# Altium schematic sheet Peripherals.SchDoc: Peripherals
size A4; SheetNumber: 2; SheetTotal: 2
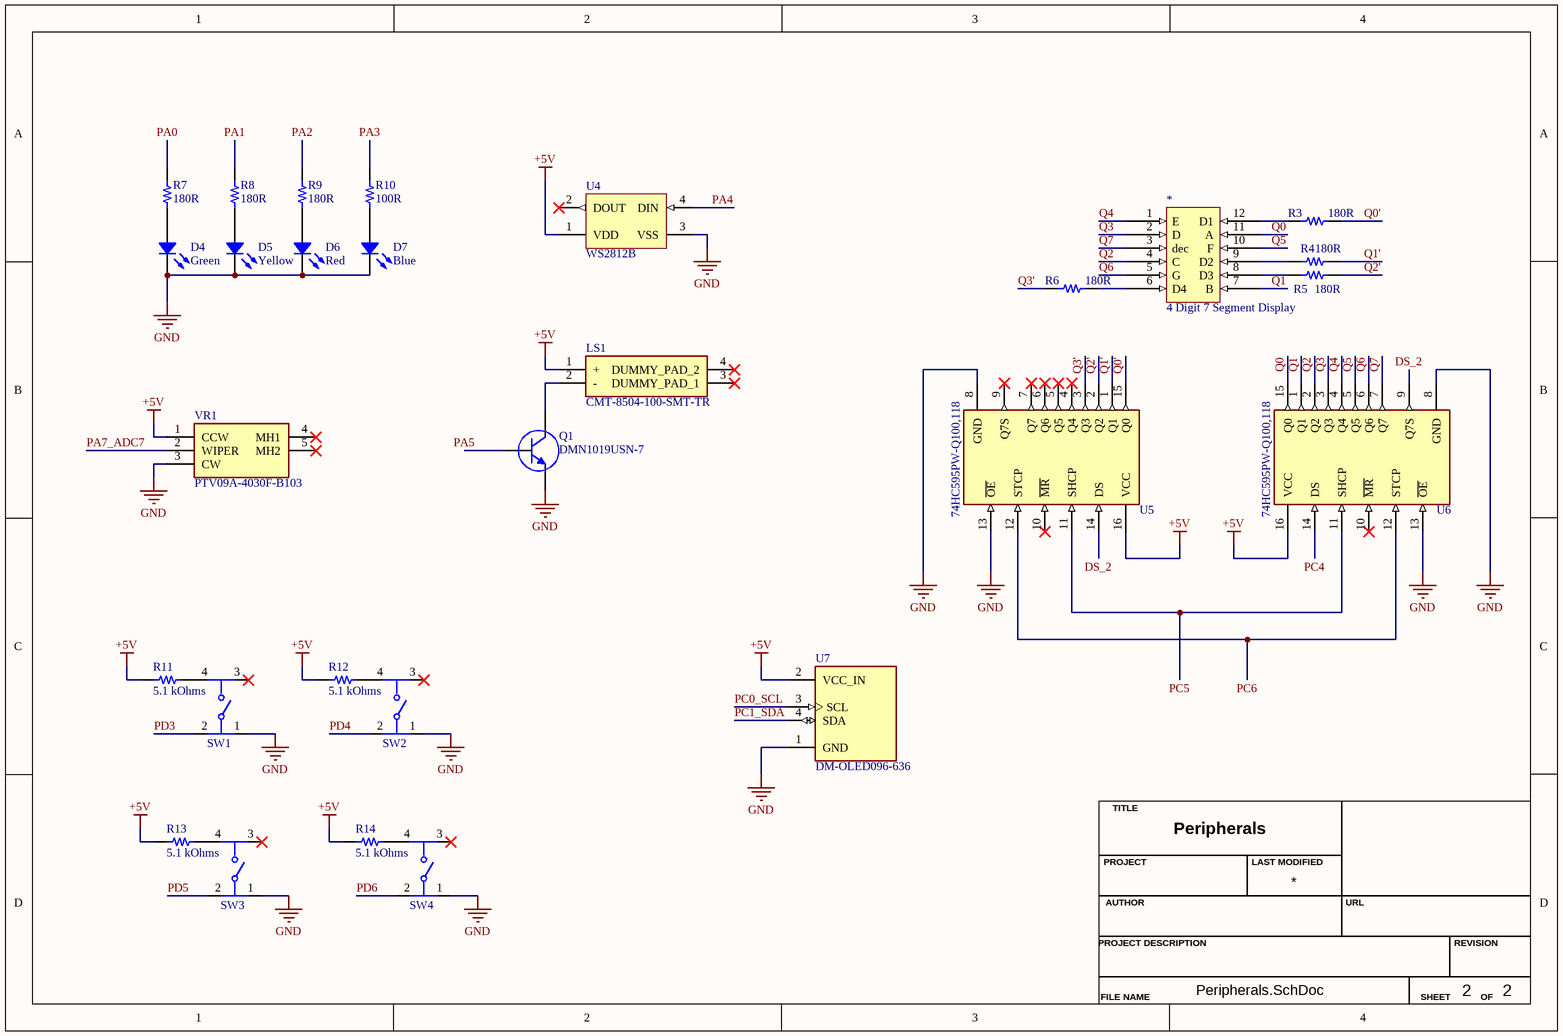
[diagram p0: Peripherals.SchDoc]

## Parts
*  4 Digit 7 Segment Display  [4 Digit 7 Segment Display -Footprint-1]
D4  Green  [LED 1206_3216 GREEN]
D5  Yellow  [LED 1206_3216 YELLOW]
D6  Red  [LED 1206_3216 RED]
D7  Blue  [LED 1206_3216 BLUE]
LS1  CMT-8504-100-SMT-TR  [CMT8504100SMTTR]
Q1  DMN1019USN-7  [FP-SC59-MFG]
R3  180R  [RES 0805_2012]
R4  180R  [RES 0805_2012]
R5  180R  [RES 0805_2012]
R6  180R  [RES 0805_2012]
R7  180R  [RES 0805_2012]
R8  180R  [RES 0805_2012]
R9  180R  [RES 0805_2012]
R10  100R  [RES 0805_2012]
R11  5.1 kOhms  [RES 0805_2012]
R12  5.1 kOhms  [RES 0805_2012]
R13  5.1 kOhms  [RES 0805_2012]
R14  5.1 kOhms  [RES 0805_2012]
SW1  PTS526SK15SMTR2LFS  [FP-PTS526SK15SMTR2LFS-MFG]  (value not drawn)
SW2  PTS526SK15SMTR2LFS  [FP-PTS526SK15SMTR2LFS-MFG]  (value not drawn)
SW3  PTS526SK15SMTR2LFS  [FP-PTS526SK15SMTR2LFS-MFG]  (value not drawn)
SW4  PTS526SK15SMTR2LFS  [FP-PTS526SK15SMTR2LFS-MFG]  (value not drawn)
U4  WS2812B  [ADAI-WS2812B_V]
U5  74HC595PW-Q100,118  [FP-SOT403-1-IPC_A]
U6  74HC595PW-Q100,118  [FP-SOT403-1-IPC_A]
U7  DM-OLED096-636  [MODULE_DM-OLED096-636]
VR1  PTV09A-4030F-B103  [PTV09A4030FB103]

## Nets
+5V: LS1.1(+) R11.2 R12.2 R13.2 R14.2 U4.1(VDD) U5.16(VCC) U6.16(VCC) U7.2(VCC_IN) VR1.1(CCW)
GND: D4.2 D5.2 D6.2 D7.2 Q1.1(E) SW1.1 SW2.1 SW3.1 SW4.1 U4.3(VSS) U5.8(GND) U5.13(~{OE}) U6.8(GND) U6.13(~{OE}) U7.1(GND) VR1.3(CW)
DS_2: U5.14(DS) U6.9(Q7S)
PA0: R7.2
PA1: R8.2
PA2: R9.2
PA3: R10.2
PA4: U4.4(DIN)
PA5: Q1.2(B)
PA7_ADC7: VR1.2(WIPER)
PC0_SCL: U7.3(SCL)
PC1_SDA: U7.4(SDA)
PC4: U6.14(DS)
PC5: U5.11(SHCP) U6.11(SHCP)
PC6: U5.12(STCP) U6.12(STCP)
PD3: SW1.2
PD4: SW2.2
PD5: SW3.2
PD6: SW4.2
Q0: *.11(A) U6.15(Q0)
Q0': R3.1 U5.15(Q0)
Q1: *.7(B) U6.1(Q1)
Q1': R4.2 U5.1(Q1)
Q2: *.4(C) U6.2(Q2)
Q2': R5.2 U5.2(Q2)
Q3: *.2(D) U6.3(Q3)
Q3': R6.2 U5.3(Q3)
Q4: *.1(E) U6.4(Q4)
Q5: *.10(F) U6.5(Q5)
Q6: *.5(G) U6.6(Q6)
Q7: *.3(dec) U6.7(Q7)
Net*_6: *.6(D4) R6.1
Net*_8: *.8(D3) R5.1
Net*_9: *.9(D2) R4.1
Net*_12: *.12(D1) R3.2
NetD4_1: D4.1 R7.1
NetD5_1: D5.1 R8.1
NetD6_1: D6.1 R9.1
NetD7_1: D7.1 R10.1
NetLS1_2: LS1.2(-) Q1.3(C)
NetR11_1: R11.1 SW1.4
NetR12_1: R12.1 SW2.4
NetR13_1: R13.1 SW3.4
NetR14_1: R14.1 SW4.4

Not connected (* = marked no-connect by the designer): LS1 3(DUMMY_PAD_1)* 4(DUMMY_PAD_2)*; SW1 3*; SW2 3*; SW3 3*; SW4 3*; U4 2(DOUT)*; U5 4(Q4)* 5(Q5)* 6(Q6)* 7(Q7)* 9(Q7S)* 10(~{MR})*; U6 10(~{MR})*; VR1 4(MH1)* 5(MH2)*

## Notes on the sheet
- TITLE
- AUTHOR
- PROJECT
- LAST MODIFIED
- URL
- PROJECT DESCRIPTION
- REVISION
- FILE NAME
- SHEET
- OF

## Library data of the parts
* = CMP-00026-00001-2: 3461AS 4 digit 7 segment display
D4 = SML-LX1206SUGC-TR: LED GREEN CLEAR 1206 SMD; Manufacturer: Lumex Opto/Components Inc.; Configuration: Standard; Current - Test: 20mA; Lens Color: Colorless; Lens Size: 2.00mm x 1.50mm; Lens Style: Rectangle with Flat Top; Millicandela Rating: 45mcd; Viewing Angle: 140°; Voltage - Forward (Vf) (Typ): 2.2V; Wavelength - Peak: 574nm; Part Number: SML-LX1206SUGC-TR; Color: Green; ComponentLink1Description: Datasheet; ComponentLink1URL: https://www.lumex.com/content/files/ProductAttachment/SML-LX1206SUGC-TR.pdf; ComponentLink2Description: DigiKey Link; ComponentLink2URL: https://www.digikey.com/en/products/detail/lumex-opto-components-inc/SML-LX1206SUGC-TR/467545; Device Package: 1206 (3216 Metric); Height (Max): 1.10mm; LastUpdated: 6/3/2024 7:59:11 PM; Lens Transparency: Clear; Lifecycle Status: Active; Minimum Order: 1; Mounting Type: Surface Mount; Package / Case: 1206 (3216 Metric); Packaging: TapeAndReel; PartId: 530; Part Status: Active; Price: 0.07; Series: -; Size / Dimension: 3.20mm L x 1.60mm W; Supplier 1: DigiKey; Supplier Part Number 1: 67-1698-1-ND; Supplier Device Package: 1206; Value: Green
D5 = SM1206NYC-IL: LED YELLOW CLEAR 1206 SMD; Manufacturer: Bivar Inc.; Configuration: Standard; Current - Test: 20mA; Lens Color: Colorless; Lens Size: 1.10mm Dia; Lens Style: Round with Flat Top; Millicandela Rating: 1000mcd; Viewing Angle: 30°; Voltage - Forward (Vf) (Typ): 2V; Wavelength - Dominant: 592nm; Wavelength - Peak: 590nm; Part Number: SM1206NYC-IL; Color: Yellow; ComponentLink1Description: Datasheet; ComponentLink1URL: https://www.bivar.com/Files/Datasheets/SM1206NYC-IL.pdf; ComponentLink2Description: DigiKey Link; ComponentLink2URL: https://www.digikey.com/en/products/detail/bivar-inc/SM1206NYC-IL/5030135; Device Package: 1206 (3216 Metric); Height (Max): 1.40mm; LastUpdated: 6/3/2024 8:01:38 PM; Lens Transparency: Clear; Lifecycle Status: Active; Minimum Order: 1; Mounting Type: Surface Mount; Package / Case: 1206 (3216 Metric); Packaging: TapeAndReel; PartId: 27; Part Status: Active; Price: 0.15; Series: -; Size / Dimension: 3.20mm L x 1.60mm W; Supplier 1: DigiKey; Supplier Part Number 1: 492-1947-1-ND; Supplier Device Package: 1206; Value: Yellow
D6 = BL-HUF33J-AV-TRB: LED RED CLEAR 1206 SMD; Manufacturer: American Bright Optoelectronics Corporation; Configuration: 1206; Current - Test: 20mA; Lens Color: Colorless; Lens Size: 1.35mm Dia; Lens Style: Round with Domed Top; Millicandela Rating: 1070mcd; Viewing Angle: 30°; Voltage - Forward (Vf) (Typ): 2.2V; Wavelength - Dominant: 633nm; Wavelength - Peak: 645nm; Part Number: BL-HUF33J-AV-TRB; Color: Red; ComponentLink1Description: Datasheet; ComponentLink1URL: http://americanbrightled.com/pdffiles/smt/BL-HUF33J-AV-TRB.pdf; ComponentLink2Description: DigiKey Link; ComponentLink2URL: https://www.digikey.com/en/products/detail/american-bright-optoelectronics-corporation/BL-HUF33J-AV-TRB/9678186; Device Package: 1206 (3216 Metric); Height (Max): 2.70mm; LastUpdated: 6/3/2024 8:00:41 PM; Lens Transparency: Clear; Lifecycle Status: Active; Minimum Order: 1; Mounting Type: Surface Mount; Package / Case: 1206 (3216 Metric); Packaging: TapeAndReel; PartId: 181; Part Status: Active; Price: 0.06; Series: -; Size / Dimension: 3.20mm L x 1.60mm W; Supplier 1: DigiKey; Supplier Part Number 1: BL-HUF33J-AV-TRBCT-ND; Supplier Device Package: 1206; Value: Red
D7 = SML-LX1206USBC-TR: LED BLUE CLEAR 1206 SMD; Manufacturer: Lumex Opto/Components Inc.; Configuration: Standard; Current - Test: 20mA; Lens Color: Colorless; Lens Size: 2.00mm x 1.50mm; Lens Style: Rectangle with Flat Top; Millicandela Rating: 25mcd; Viewing Angle: 140°; Voltage - Forward (Vf) (Typ): 3.5V; Wavelength - Peak: 470nm; Part Number: SML-LX1206USBC-TR; Color: Blue; ComponentLink1Description: Datasheet; ComponentLink1URL: https://www.lumex.com/content/files/ProductAttachment/SML-LX1206USBC-TR.pdf; ComponentLink2Description: DigiKey Link; ComponentLink2URL: https://www.digikey.com/en/products/detail/lumex-opto-components-inc/SML-LX1206USBC-TR/467547; Device Package: 1206 (3216 Metric); Height (Max): 1.10mm; LastUpdated: 6/3/2024 7:58:07 PM; Lens Transparency: Clear; Lifecycle Status: Active; Minimum Order: 1; Mounting Type: Surface Mount; Package / Case: 1206 (3216 Metric); Packaging: TapeAndReel; PartId: 732; Part Status: Active; Price: 0.58; Series: -; Size / Dimension: 3.20mm L x 1.60mm W; Supplier 1: DigiKey; Supplier Part Number 1: 67-1701-1-ND; Supplier Device Package: 1206; Value: Blue
LS1 = CMT-8504-100-SMT-TR: Loudspeaker or Buzzer; Manufacturer_Name: Same Sky; Datasheet Link: https://www.sameskydevices.com/product/resource/cmt-8504-100-smt-tr.pdf; Height: 4.5mm; Manufacturer_Part_Number: CMT-8504-100-SMT-TR; Mouser Part Number: 490-CMT-8504100SMTTR; Mouser Price/Stock: https://www.mouser.co.uk/ProductDetail/Same-Sky/CMT-8504-100-SMT-TR?qs=P1JMDcb91o7N%2FrNVZpuJrw%3D%3D; Arrow Part Number: CMT-8504-100-SMT-TR; Arrow Price/Stock: https://www.arrow.com/en/products/cmt-8504-100-smt-tr/cui-devices?utm_currency=USD&region=nac
Q1 = CMP-013-00037-1: Small Signal Field-Effect Transistor, 9.3A I(D), 12V, 1-Element, N-Channel, Silicon, Metal-oxide Semiconductor FET; RoHS Compliant: Yes
R3-R9 = CRCW0805180RFKEAHP: RES SMD 180 OHM 1% 1/2W 0805; Manufacturer: Vishay Dale; Power (Watts): 0.5W, 1/2W; Resistance: 180 Ohms; Temperature Coefficient: ±100ppm/°C; Part Number: CRCW0805180RFKEAHP; Value: 180R; ComponentLink1Description: Datasheet; ComponentLink1URL: http://www.vishay.com/docs/20043/crcwhpe3.pdf; ComponentLink2Description: DigiKey Link; ComponentLink2URL: https://www.digikey.com/en/products/detail/vishay-dale/CRCW0805180RFKEAHP/2226882; Composition: Thick Film; Device Package: 0805 (2012 Metric); Features: Automotive AEC-Q200, Pulse Withstanding; Height - Seated (Max): 0.020" (0.50mm); LastUpdated: 2/8/2024 9:02:28 PM; Lifecycle Status: Active; Minimum Order: 1; Number of Terminations: 2; Operating Temperature: -55°C ~ 155°C; Package / Case: 0805 (2012 Metric); Packaging: TapeAndReel; PartId: 30363; Part Status: Active; Price: 0.02; Ratings: AEC-Q200; Series: CRCW-HP; Size / Dimension: 0.079" L x 0.049" W (2.00mm x 1.25mm); Supplier 1: DigiKey; Supplier Part Number 1: 541-180TCT-ND; Supplier Device Package: 0805; Tolerance: ±1%
R10 = RCS0805100RFKEA: RES SMD 100 OHM 1% 1/2W 0805; Manufacturer: Vishay Dale; Power (Watts): 0.5W, 1/2W; Resistance: 100 Ohms; Temperature Coefficient: ±100ppm/°C; Part Number: RCS0805100RFKEA; Value: 100R; ComponentLink1Description: Datasheet; ComponentLink1URL: http://www.vishay.com/docs/20065/rcse3.pdf; ComponentLink2Description: DigiKey Link; ComponentLink2URL: https://www.digikey.com/en/products/detail/vishay-dale/RCS0805100RFKEA/5866980; Composition: Thick Film; Device Package: 0805 (2012 Metric); Features: Automotive AEC-Q200, Pulse Withstanding; Height - Seated (Max): 0.020" (0.50mm); LastUpdated: 2/8/2024 9:02:38 PM; Lifecycle Status: Active; Minimum Order: 1; Number of Terminations: 2; Operating Temperature: -55°C ~ 155°C; Package / Case: 0805 (2012 Metric); Packaging: TapeAndReel; PartId: 27784; Part Status: Active; Price: 0.02; Ratings: AEC-Q200; Series: RCS e3; Size / Dimension: 0.079" L x 0.049" W (2.00mm x 1.25mm); Supplier 1: DigiKey; Supplier Part Number 1: 541-2834-1-ND; Supplier Device Package: 0805; Tolerance: ±1%
R11-R14 = RMCF0805FT5K10: RES 5.1K OHM 1% 1/8W 0805; Manufacturer: Stackpole Electronics Inc; Power (Watts): 0.125W, 1/8W; Temperature Coefficient: ±100ppm/°C; Part Number: RMCF0805FT5K10; Value: 5.1 kOhms; ComponentLink1Description: Datasheet; ComponentLink1URL: https://www.seielect.com/catalog/sei-rmcf_rmcp.pdf; ComponentLink2Description: DigiKey Link; ComponentLink2URL: https://www.digikey.com/en/products/detail/stackpole-electronics-inc/RMCF0805FT5K10/1760394; Composition: Thick Film; Device Package: 0805 (2012 Metric); Features: Automotive AEC-Q200; Height - Seated (Max): 0.026" (0.65mm); LastUpdated: 2/8/2024 9:02:18 PM; Lifecycle Status: Active; Minimum Order: 1; Number of Terminations: 2; Operating Temperature: -55°C ~ 155°C; Package / Case: 0805 (2012 Metric); Packaging: CutTape; PartId: 32512; Part Status: Active; Price: 0.01; Ratings: AEC-Q200; Resistance: 5.1 kOhms; Series: RMCF; Size / Dimension: 0.079" L x 0.049" W (2.00mm x 1.25mm); Supplier 1: DigiKey; Supplier Part Number 1: RMCF0805FT5K10CT-ND; Supplier Device Package: 0805; Tolerance: ±1%
SW1-SW4 = CMP-011-00013-1: Switch Tactile N.O. SPST Round Button Gull Wing 0.05A 12VDC 200000Cycles 2.45N SMD T/R
U4 = CMP-007-00035-2: Intelligent Control LED Integrated Light Source, 3.5 to 5.3 V, -25 to 80 degC, 4-Pin SMD, RoHS, Bulk; Manufacturer: Adafruit Industries; Datasheet URL: https://cdn-shop.adafruit.com/datasheets/WS2812B.pdf; Manufacturer URL: https://www.adafruit.com/; Datasheet Version: May-13; Case/Package: WS2812B; Mounting Technology: SM; RoHS Compliant: False; Package Description: 4-Pin Surface Mount Device, Body 5 x 5 mm, Pitch 3.3 mm; Package Reference: WS2812B
U5 U6 = CMP-016-00011-1: Serial In Parallel Out, HC/UH Series, 8-Bit, Right Direction, True Output, CMOS, PDSO16; Max Supply Voltage: 6V; Nominal Supply Voltage: 5V; Min Supply Voltage: 2V; RoHS Compliant: Yes; Max Operating Temperature: 125°C; Pins: 16; Min Operating Temperature: -40°C; Logic Type: SERIAL IN PARALLEL OUT; Case/Package: TSSOP
U7 = CMP-00026-00002-1: 0.96â€ 128 X 64 MONOCHROME GRAPHIC OLED DISPLAY MODULE - I2C; Pins: 4; Design Item ID: DM-OLED096-636; SnapEDA_Link: https://www.snapeda.com/parts/DM-OLED096-636/Display+Module/view-part/?ref=snap; Case/Package: Package; Source: DM-OLED096-636.SchLib; MF: Display Module; Value: *; Check_prices: https://www.snapeda.com/parts/DM-OLED096-636/Display+Module/view-part/?ref=eda; Component Type: Standard; MP: DM-OLED096-636
VR1 = PTV09A-4030F-B103: Variable Resistor; Manufacturer_Name: Bourns; Datasheet Link: https://www.bourns.com/docs/product-datasheets/PTV09.pdf; Height: 30.5mm; Manufacturer_Part_Number: PTV09A-4030F-B103; Mouser Part Number: 652-PTV09A4030FB103; Mouser Price/Stock: https://www.mouser.co.uk/ProductDetail/Bourns/PTV09A-4030F-B103?qs=Zq5ylnUbLm4pfFuWlwC80Q%3D%3D; Arrow Part Number: PTV09A-4030F-B103; Arrow Price/Stock: https://www.arrow.com/en/products/ptv09a-4030f-b103/bourns